# Altium schematic sheet 风扇_V1.9.SchDoc: 风扇-衣架
size 304 x 241 mm
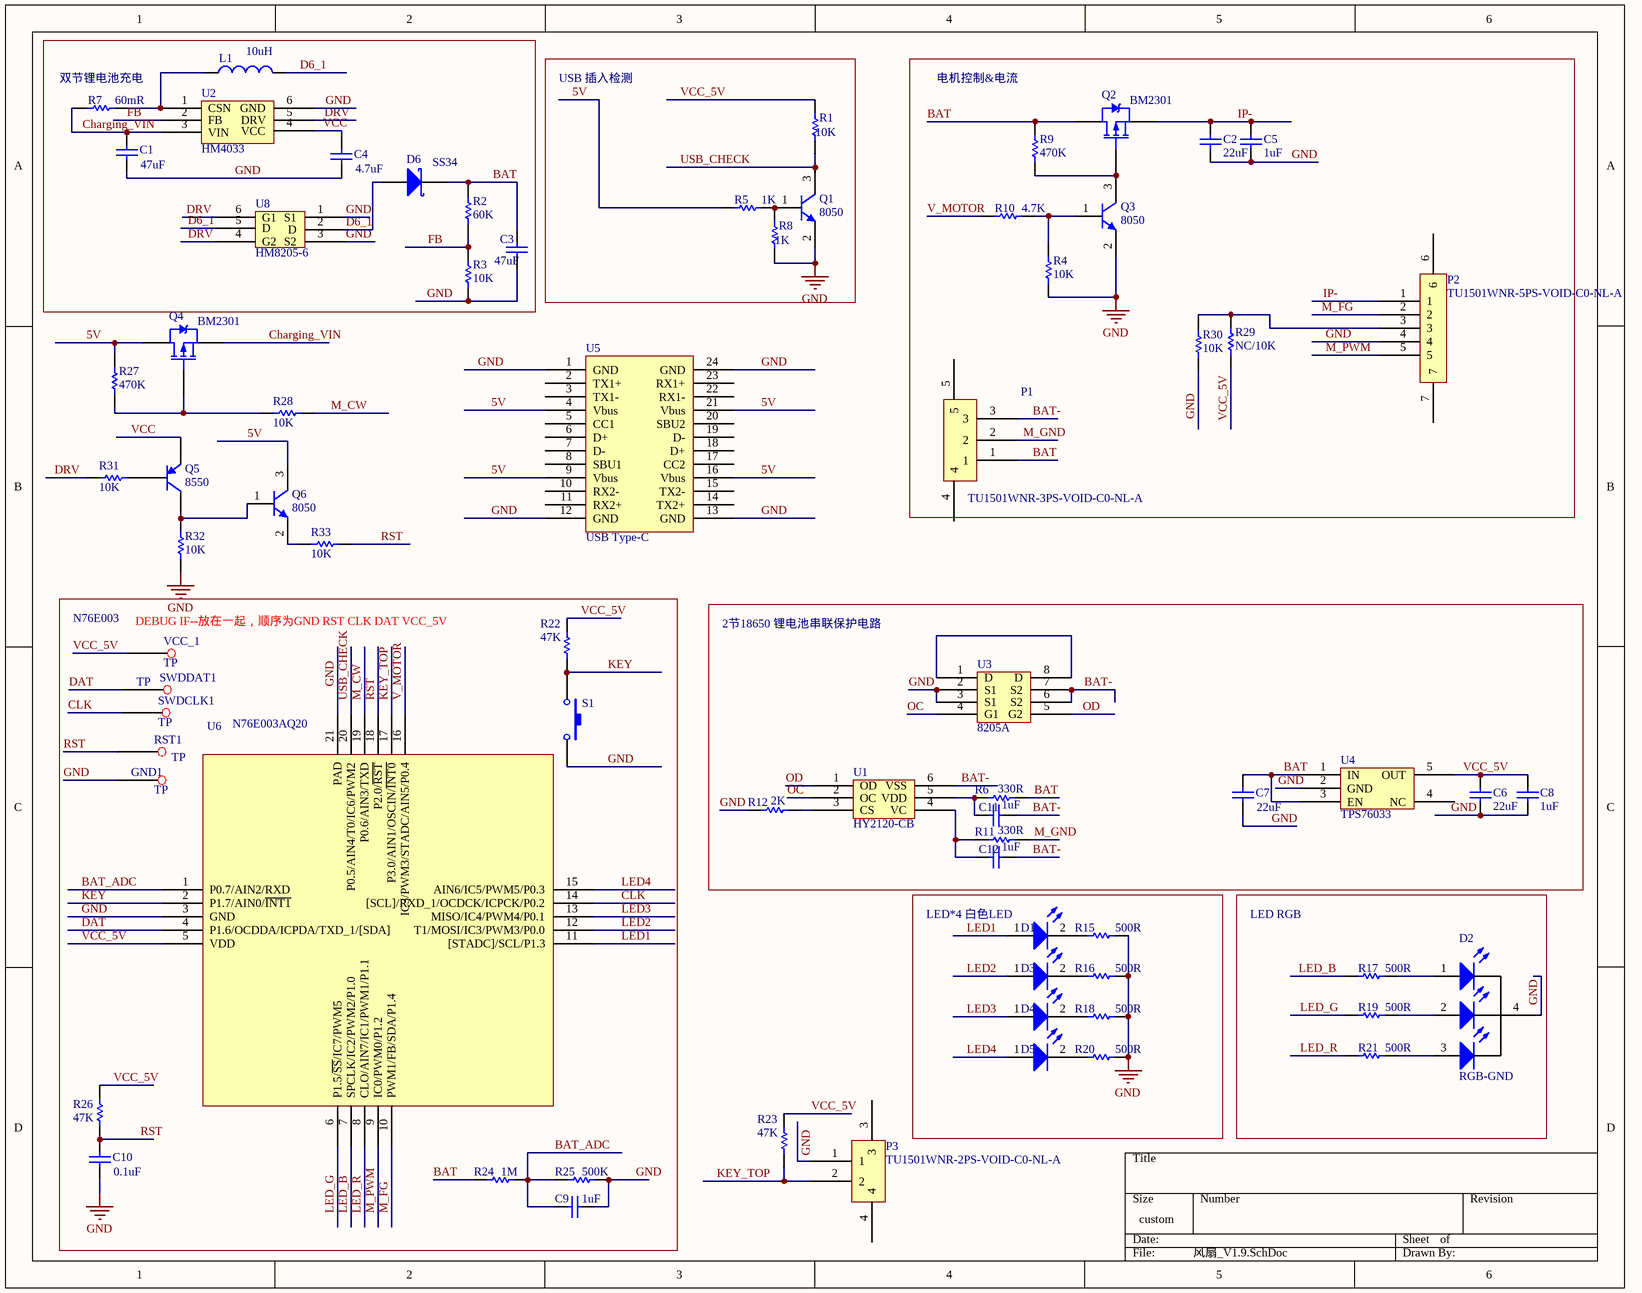
[diagram p0: 风扇_V1.9.SchDoc]

## Parts
C1  47uF  [C-0603]
C2  22uF  [C-0603]
C3  47uF  [C-0603]
C4  4.7uF  [C-0402]
C5  1uF  [C-0402]
C6  22uF  [C-0603]
C7  22uF  [C-0603]
C8  1uF  [C-0402]
C9  1uF  [C-0402]
C10  0.1uF  [C-0402]
C11  1uF  [C-0402]
C12  1uF  [C-0402]
D1  LED0  [LED-0603]  (value not drawn)
D2  RGB-GND  [0603*2-LED]
D3  LED0  [LED-0603]  (value not drawn)
D4  LED0  [LED-0603]  (value not drawn)
D5  LED0  [LED-0603]  (value not drawn)
D6  SS34  [DSMD]
GND1  TP  [TP-1.5]
L1  10uH  [L-SMD]
P1  TU1501WNR-3PS-VOID-C0-NL-A  [TU1501WNR-3PS-VOID-*-NL-A]
P2  TU1501WNR-5PS-VOID-C0-NL-A  [TU1501WNR-5PS-VOID-*-NL-A]
P3  TU1501WNR-2PS-VOID-C0-NL-A  [TU1501WNR-2PS-VOID-*-NL-A]
Q1  8050  [SOT-23]
Q2  BM2301  [SOT-23]
Q3  8050  [SOT-23]
Q4  BM2301  [SOT-23]
Q5  8550  [SOT95P240-3N]
Q6  8050  [SOT-23]
R1  10K  [R-0402]
R2  60K  [R-0402]
R3  10K  [R-0402]
R4  10K  [R-0402]
R5  1K  [R-0402]
R6  330R  [R-0402]
R7  60mR  [R-0402]
R8  1K  [R-0402]
R9  470K  [R-0402]
R10  4.7K  [R-0402]
R11  330R  [R-0402]
R12  2K  [R-0402]
R15  500R  [R-0402]
R16  500R  [R-0402]
R17  500R  [R-0402]
R18  500R  [R-0402]
R19  500R  [R-0402]
R20  500R  [R-0402]
R21  500R  [R-0402]
R22  47K  [R-0402]
R23  47K  [R-0402]
R24  1M  [R-0402]
R25  500K  [R-0402]
R26  47K  [R-0402]
R27  470K  [R-0402]
R28  10K  [R-0402]
R29  NC/10K  [R-0402]
R30  10K  [R-0402]
R31  10K  [R-0402]
R32  10K  [R-0402]
R33  10K  [R-0402]
RST1  TP  [TP-1.5]
S1  SW-PB  [SWITCH-4P-SMT]  (value not drawn)
SWDCLK1  TP  [TP-1.5]
SWDDAT1  TP  [TP-1.5]
U1  HY2120-CB  [SOT-23-6L]
U2  HM4033  [SOT-23-6L]
U3  8205A  [TSSOP8]
U4  TPS76033  [SOT-23-5]
U5  USB Type-C  [USB-type C]
U6  N76E003AQ20  [QFN-20 0.4mm]
U8  HM8205-6  [SOT-23-6L]
VCC_1  TP  [TP-1.5]

## Blocks framed on the sheet
双节锂电池充电: C1 C3 C4 D6 L1 R2 R3 R7 U2 U8
USB 插入检测: Q1 R1 R5 R8
电机控制&电流: C2 C5 P1 P2 Q2 Q3 R4 R9 R10 R29 R30
2节18650 锂电池串联保护电路: C6-C8 C11 C12 R6 R11 R12 U1 U3 U4
LED*4 白色LED: D1 D3-D5 R15 R16 R18 R20
LED RGB: D2 R17 R19 R21

## Nets
GND: C1.2 C2.1 C3.1 C4.2 C5.1 C6.1 C7.1 C8.1 C9.1 C10.1 D2.4 GND1.1 P2.4 P3.1 Q1.2(E) Q3.2(E) R3.2 R4.1 R8.2 R12.1 R15.2 R16.2 R18.2 R20.2 R25.2 R30.2 R32.1 S1.2 U2.6(GND) U3.2(S1) U3.3(S1) U4.2(GND) U5.1(GND) U5.12(GND) U5.13(GND) U5.24(GND) U6.3(GND) U6.21(PAD) U8.1(S1) U8.3(S2)
5V: Q4.2(D) Q6.3(C) R5.1 R27.2 U5.4(Vbus) U5.9(Vbus) U5.16(Vbus) U5.21(Vbus)
BAT: C3.2 C7.2 D6.1(K) P1.1 Q2.2(D) R2.1 R6.2 R9.2 R24.1 U4.1(IN) U4.3(EN)
BAT-: C11.1 C12.1 P1.3 U1.6(VSS) U3.6(S2) U3.7(S2)
BAT_ADC: C9.2 R24.2 R25.1 U6.1(P0.7/AIN2/RXD)
Charging_VIN: C1.1 Q4.3(S) R7.2 U2.3(VIN)
CLK: SWDCLK1.1 U6.14([SCL]/RXD_1/OCDCK/ICPCK/P0.2)
D6_1: D6.3(A) L1.2 U8.2(D) U8.5(D)
DAT: SWDDAT1.1 U6.4(P1.6/OCDDA/ICPDA/TXD_1/[SDA])
DRV: R31.1 U2.5(DRV) U8.4(G2) U8.6(G1)
FB: R2.2 R3.1 U2.2(FB)
IP-: C2.2 C5.2 P2.1 Q2.3(S)
KEY: R22.1 S1.1 U6.2(P1.7/AIN0/~{INT1})
KEY_TOP: P3.2 R23.1 U6.17(P3.0/AIN1/OSCIN/~{INT0})
LED1: D1.1(A) U6.11([STADC]/SCL/P1.3)
LED2: D3.1(A) U6.12(T1/MOSI/IC3/PWM3/P0.0)
LED3: D4.1(A) U6.13(MISO/IC4/PWM4/P0.1)
LED4: D5.1(A) U6.15(AIN6/IC5/PWM5/P0.3)
LED_B: R17.1 U6.7(SPCLK/IC2/PWM2/P1.0)
LED_G: R19.1 U6.6(P1.5/~{SS}/IC7/PWM5)
LED_R: R21.1 U6.8(CLO/AIN7/IC1/PWM1/P1.1)
M_CW: R28.1 U6.19(P0.6/AIN3/TXD)
M_FG: P2.2 U6.10(PWM1/FB/SDA/P1.4)
M_GND: P1.2 R11.2
M_PWM: P2.5 U6.9(IC0/PWM0/P1.2)
OC: U1.2(OC) U3.4(G1)
OD: U1.1(OD) U3.5(G2)
RST: C10.2 R26.1 R33.1 RST1.1 U6.18(P2.0/~{RST})
USB_CHECK: Q1.3(C) R1.1 U6.20(P0.5/AIN4/T0/IC6/PWM2)
V_MOTOR: R10.1 U6.16(IC3/PWM3/STADC/AIN5/P0.4)
VCC: C4.1 Q5.3(E) U2.4(VCC)
VCC_5V: C6.2 C8.2 R1.2 R22.2 R23.2 R26.2 R29.2 U4.5(OUT) U6.5(VDD) VCC_1.1
NetC11_2: C11.2 R6.1 U1.5(VDD)
NetC12_2: C12.2 R11.1 U1.4(VC)
NetD1_2: D1.2(K) R15.1
NetD2_1: D2.1 R17.2
NetD2_2: D2.2 R19.2
NetD2_3: D2.3 R21.2
NetD3_2: D3.2(K) R16.1
NetD4_2: D4.2(K) R18.1
NetD5_2: D5.2(K) R20.1
NetL1_1: L1.1 R7.1 U2.1(CSN)
NetP2_3: P2.3 R29.1 R30.1
NetQ1_1: Q1.1(B) R5.2 R8.1
NetQ2_1: Q2.1(G) Q3.3(C) R9.1
NetQ3_1: Q3.1(B) R4.2 R10.2
NetQ4_1: Q4.1(G) R27.1 R28.2
NetQ5_1: Q5.1(C) Q6.1(B) R32.2
NetQ5_2: Q5.2(B) R31.2
NetQ6_2: Q6.2(E) R33.2
NetR12_2: R12.2 U1.3(CS)
NetU3_1: U3.1(D) U3.8(D)

Not connected (* = marked no-connect by the designer): P1 4 5; P2 6 7; P3 3 4; U4 4(NC); U5 2(TX1+) 3(TX1-) 5(CC1) 6(D+) 7(D-) 8(SBU1) 10(RX2-) 11(RX2+) 14(TX2+) 15(TX2-) 17(CC2) 18(D+) 19(D-) 20(SBU2) 22(RX1-) 23(RX1+)

## Notes on the sheet
- N76E003
- (near VCC_1) DEBUG IF--放在一起，顺序为GND RST CLK DAT VCC_5V

## Library data of the parts
C1 = Cap: Capacitor; Value: 10uF; Published: 8-Jun-2000; LatestRevisionDate: 17-Jul-2002; LatestRevisionNote: Re-released for DXP Platform.; PackageReference: RAD-0.3; Publisher: Altium Limited
C2 C5-C12 = Cap: Capacitor; Published: 8-Jun-2000; LatestRevisionDate: 17-Jul-2002; LatestRevisionNote: Re-released for DXP Platform.; PackageReference: RAD-0.3; Publisher: Altium Limited
  C2 C5 C10-C12: PackageDescription: Radial Cap, Thru-Hole; 2 Leads; 0.3 in Pin Spacing
  C6 C7: Value: 22uF
  C8 C9: Value: 1uF
C3 = Cap: Capacitor; Value: 47nF; Published: 8-Jun-2000; LatestRevisionDate: 17-Jul-2002; LatestRevisionNote: Re-released for DXP Platform.; PackageReference: RAD-0.3; Publisher: Altium Limited
C4 = Cap: Capacitor; Value: 22uF; Published: 8-Jun-2000; LatestRevisionDate: 17-Jul-2002; LatestRevisionNote: Re-released for DXP Platform.; PackageReference: RAD-0.3; Publisher: Altium Limited
D1 D3-D5 = LED0: Typical INFRARED GaAs LED; Published: 8-Jun-2000; LatestRevisionDate: 08-Jul-2005; LatestRevisionNote: Mech Layer 1 removed.; PackageReference: LED-0; Publisher: Altium Limited
D6 = Diode 10TQ035: Schottky Rectifier; Note: Terminal 2 is the TAB and is electrically connected to the cathode; Published: 8-Jun-2000; LatestRevisionDate: 17-Jul-2002; LatestRevisionNote: Re-released for DXP Platform.; DatasheetVersion: PD-2.057B; PackageVersion: Feb-1998; PackageReference: TO-220AC; Publisher: Altium Limited; ComponentLink1Description: Manufacturer Link; ComponentLink1URL: http://www.irf.com/; ComponentLink2Description: Datasheet; ComponentLink2URL: http://www.irf.com/product-info/datasheets/data/10tq.pdf
L1 = Inductor: Code_IEC: 1005; Value: 4.7uH; Published: 8-Jun-2000; LatestRevisionDate: 29-May-2009; LatestRevisionNote: IPC-7351 Footprint Added.; PackageReference: 0402-A; Publisher: Altium Limited; PackageDescription: Chip Inductor; Code_JEITA: 0402
Q1 Q3 Q6 = NPN: NPN Bipolar Transistor; Published: 8-Jun-2000; LatestRevisionDate: 17-Jul-2002; LatestRevisionNote: Re-released for DXP Platform.; PackageReference: TO-226-AA; Publisher: Altium Limited; PackageDescription: TO, Flat Index; 3 In-Line, Axial Leads; Body Dia. 4.8mm; Leads 0.55 x 0.51 mm (max); Code_JEDEC: TO-226-AA
Q2 Q4 = PMOS-2: P-Channel Power MOSFET; Note: Pin 4 not drawn and electrically connected to Pin 2.; Published: 8-Jun-2000; LatestRevisionDate: 17-Jul-2002; LatestRevisionNote: Re-released for DXP Platform.; DatasheetVersion: PD-9.390D; PackageReference: TO-220AB; Publisher: Altium Limited; Code_JEDEC: TO-220-AB; ComponentLink1Description: Manufacturer Link; ComponentLink1URL: http://www.irf.com/
Q5 = PNP: PNP Bipolar Transistor; Published: 8-Jun-2000; LatestRevisionDate: 29-May-2009; LatestRevisionNote: IPC-7351 Footprint Added.; PackageVersion: Aug-1999; PackageReference: SOT-23B; Publisher: Altium Limited; PackageDescription: 3-Pin SOT-23 Package 0.95 mm Pitch, 2.4 mm Lead Span
R1 R4 R5 R9 R10 R15-R24 R26-R33 = Res1: Resistor; Published: 8-Jun-2000; LatestRevisionDate: 17-Jul-2002; LatestRevisionNote: Re-released for DXP Platform.; PackageReference: AXIAL-0.3; Publisher: Altium Limited
  R1 R4 R5 R9 R10 R17 R19 R21 R26-R33: PackageDescription: Axial Device, Thru-Hole; 2 Leads; 0.3 in Pin Spacing
  R15 R16 R18 R20: Value: 500R
  R22 R23: PackageDescription: Axial Device, Thru-Hole; 2 Leads; 0.3 in Pin Spacing; Value: 47K
  R24: Value: 1M
R2 = Res1: Resistor; Value: 1K; Published: 8-Jun-2000; LatestRevisionDate: 17-Jul-2002; LatestRevisionNote: Re-released for DXP Platform.; PackageReference: AXIAL-0.3; Publisher: Altium Limited
R3 = Res1: Resistor; Value: 3.9K; Published: 8-Jun-2000; LatestRevisionDate: 17-Jul-2002; LatestRevisionNote: Re-released for DXP Platform.; PackageReference: AXIAL-0.3; Publisher: Altium Limited
R6 R11 R12 = Res1: Resistor; Value: 3.3K; Published: 8-Jun-2000; LatestRevisionDate: 17-Jul-2002; LatestRevisionNote: Re-released for DXP Platform.; PackageReference: AXIAL-0.3; Publisher: Altium Limited
R7 = Res1: Resistor; Value: 50mR; Published: 8-Jun-2000; LatestRevisionDate: 17-Jul-2002; LatestRevisionNote: Re-released for DXP Platform.; PackageReference: AXIAL-0.3; Publisher: Altium Limited
R8 = Res1: Resistor; Value: 10K; Published: 8-Jun-2000; LatestRevisionDate: 17-Jul-2002; LatestRevisionNote: Re-released for DXP Platform.; PackageReference: AXIAL-0.3; Publisher: Altium Limited
R25 = Res1: Resistor; Value: 1M; Published: 8-Jun-2000; LatestRevisionDate: 17-Jul-2002; LatestRevisionNote: Re-released for DXP Platform.; PackageReference: AXIAL-0.3; Publisher: Altium Limited
S1 = SW-PB: Switch; Published: 24-Mar-1999; LatestRevisionDate: 17-Jul-2002; LatestRevisionNote: Re-released for DXP Platform.; PackageReference: SPST-2; Publisher: Altium Limited; PackageDescription: Switch; 2 Leads
U1 = HY2120